# EasyEDA Pro project MG_0428.eprj

# Schematic Schematic1
Board Name: Board1; Create Date: 2025-04-02; Page Name: P1; Project Name: MG_0428; Schematic Name: Schematic1; Update Date: 2025-05-14; Company: 嘉立创EDA; Page Size: A4; Version: V1.0
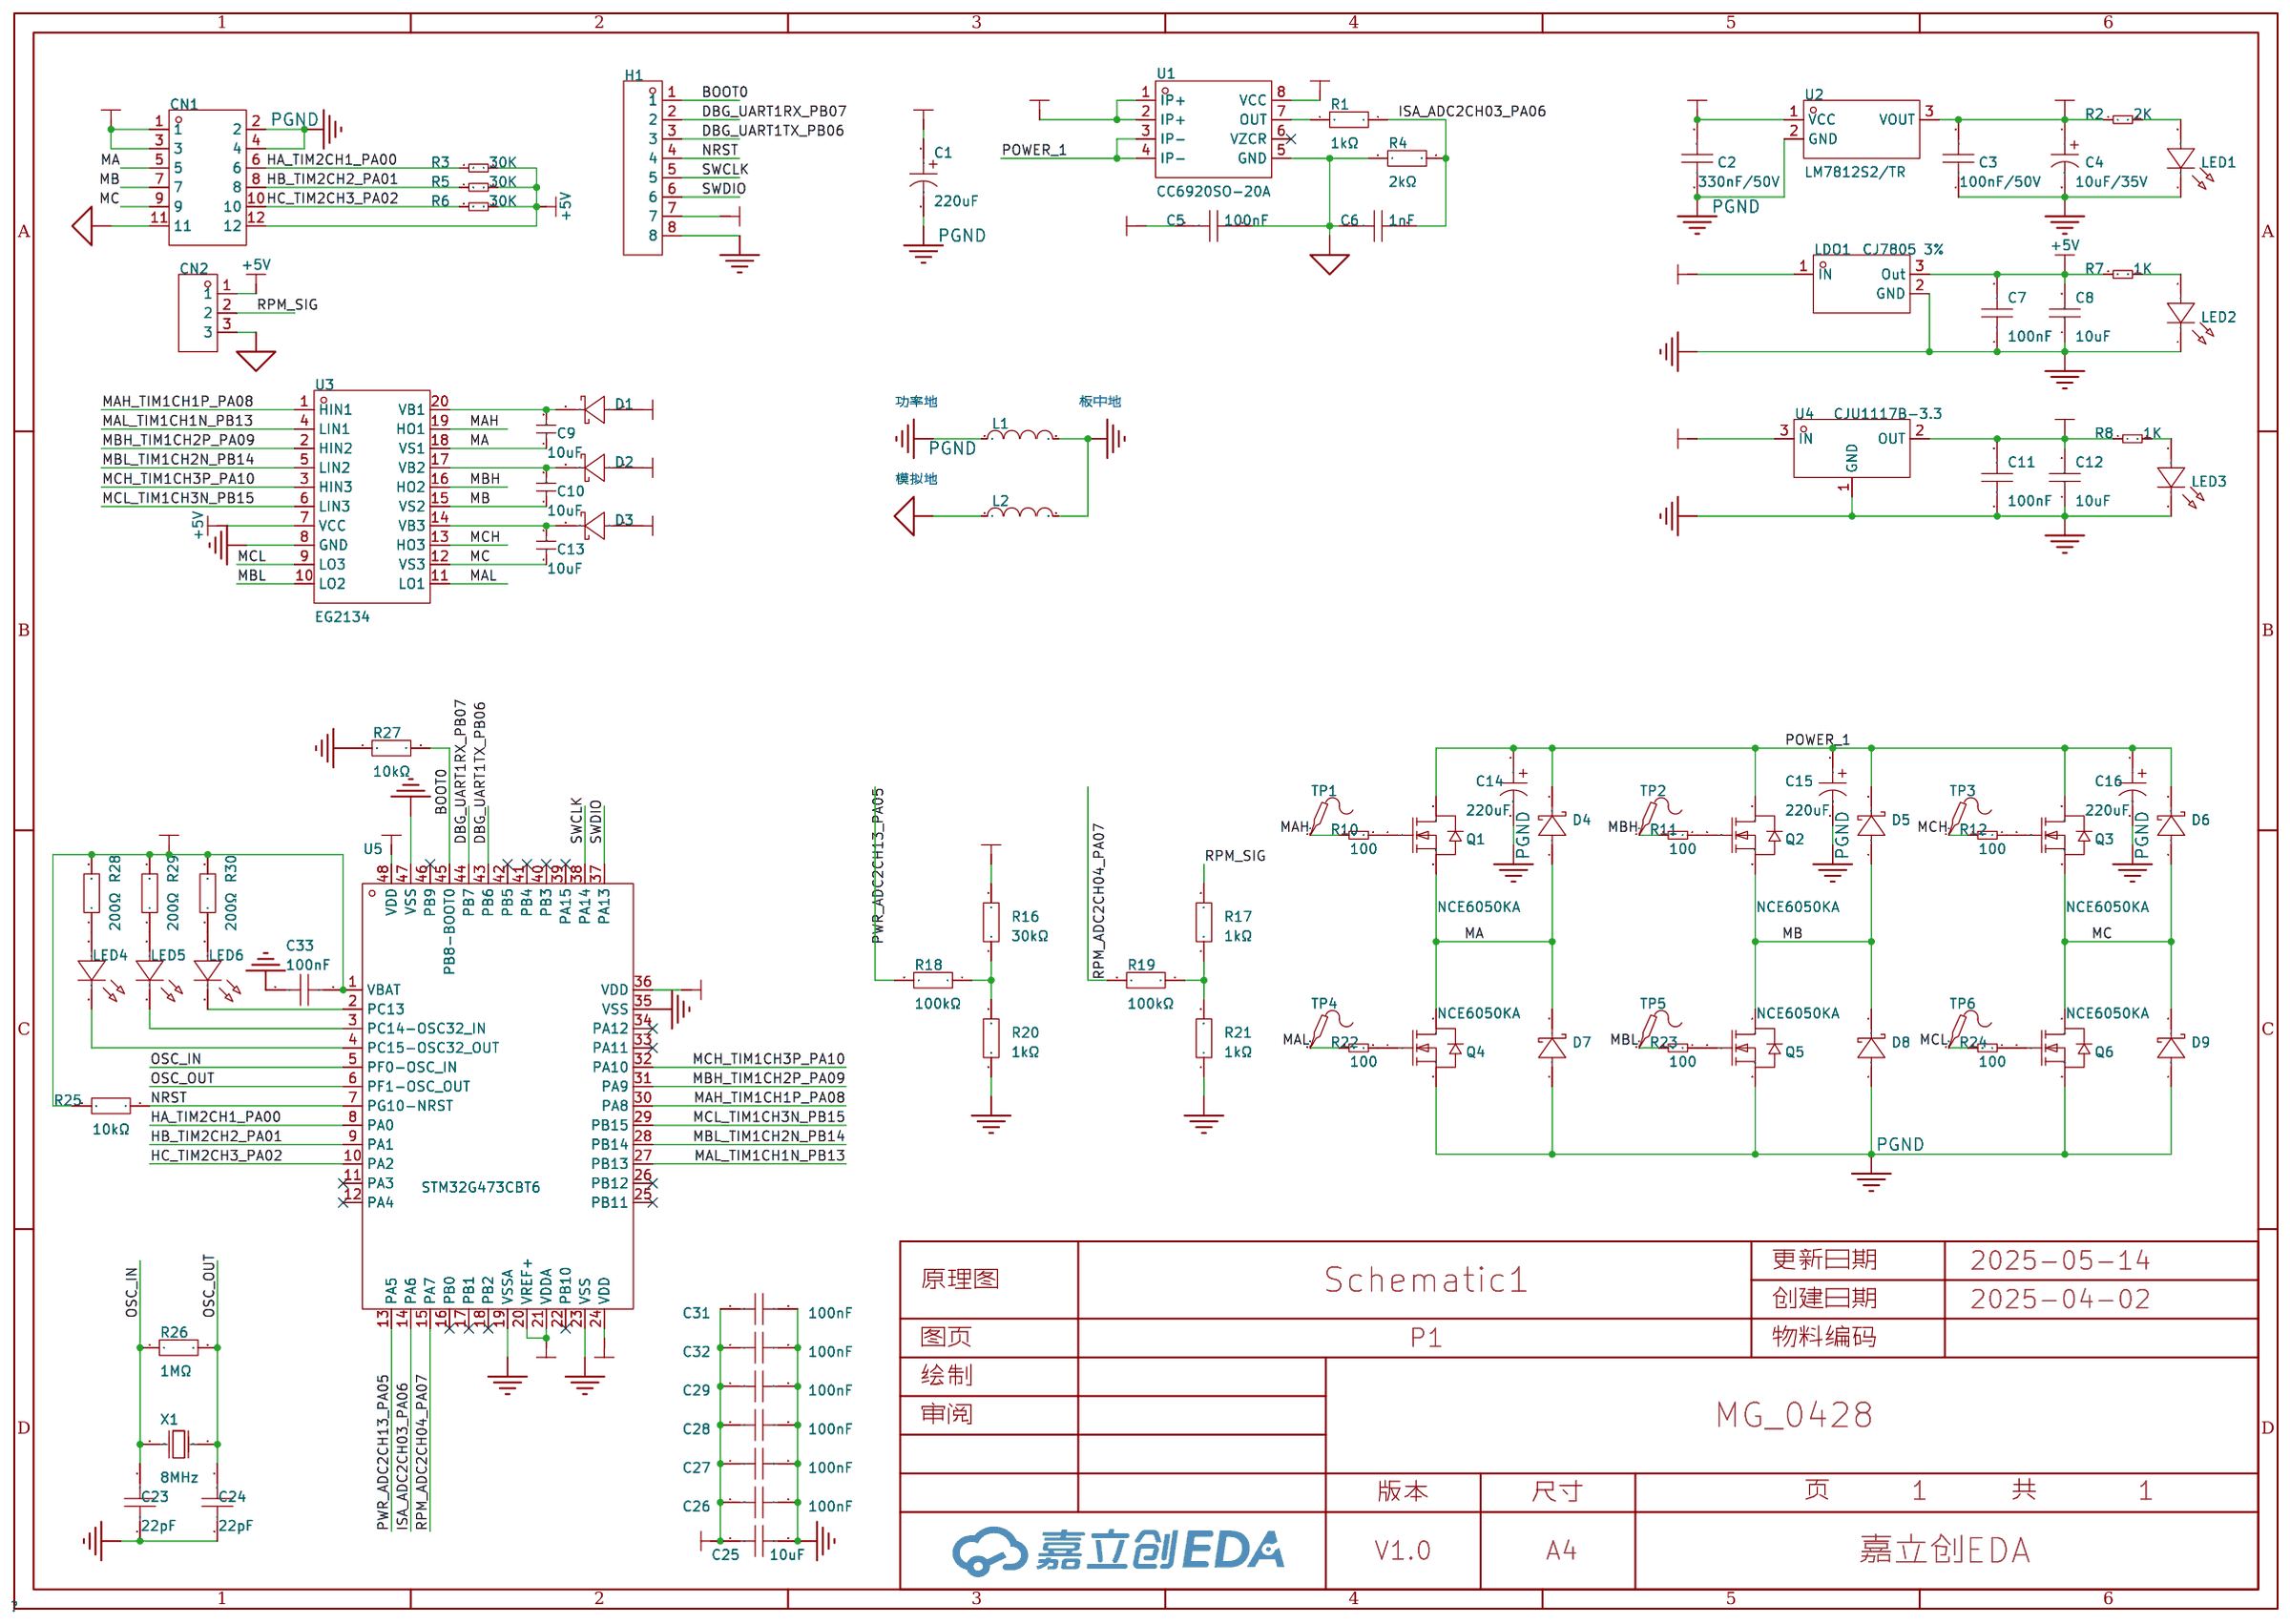
[diagram p0: schematic sheet]

## Parts
C1  220uF  [CAP-SMD_BD10.0-L10.3-W10.3-LS11.0-FD]
C2  330nF/50V  [C0603]
C3  100nF/50V  [C0603]
C4  10uF/35V  [CAP-SMD_BD6.3-L6.6-W6.6-LS7.4-FD]
C5  100nF  [C0603]
C6  1nF  [C0603]
C7  100nF  [C0603]
C8  10uF  [C1206]
C9  10uF  [C0402_NEW]
C10  10uF  [C0402_NEW]
C11  100nF  [C0603]
C12  10uF  [C1206]
C13  10uF  [C0402_NEW]
C14  220uF  [CAP-SMD_BD6.3-L6.6-W6.6-LS7.4-FD]
C15  220uF  [CAP-SMD_BD6.3-L6.6-W6.6-LS7.4-FD]
C16  220uF  [CAP-SMD_BD6.3-L6.6-W6.6-LS7.4-FD]
C23  22pF  [C0402]
C24  22pF  [C0402]
C25  10uF  [C0402]
C26  100nF  [C0402]
C27  100nF  [C0402]
C28  100nF  [C0402]
C29  100nF  [C0402]
C31  100nF  [C0402]
C32  100nF  [C0402]
C33  100nF  [C0402]
CN1  HC-MX3.0-2*6A  [CONN-TH_12P-P3.00_HC-MX3.0-2X6A]
CN2  ZX-XH2.54-3PZZ  [CONN-TH_3P-P2.54_2501S-3P]
D1  BAT46W  [SOD-123_L2.7-W1.6-LS3.7-FD]
D2  BAT46W  [SOD-123_L2.7-W1.6-LS3.7-FD]
D3  BAT46W  [SOD-123_L2.7-W1.6-LS3.7-FD]
D4  BAT46W  [SOD-123_L2.7-W1.6-LS3.7-FD]
D5  BAT46W  [SOD-123_L2.7-W1.6-LS3.7-FD]
D6  BAT46W  [SOD-123_L2.7-W1.6-LS3.7-FD]
D7  BAT46W  [SOD-123_L2.7-W1.6-LS3.7-FD]
D8  BAT46W  [SOD-123_L2.7-W1.6-LS3.7-FD]
D9  BAT46W  [SOD-123_L2.7-W1.6-LS3.7-FD]
H1  PZ254V-11-08P  [HDR-TH_8P-P2.54-V-M]
L1  CBM201209U300T  [L0805]
L2  CBM201209U300T  [L0805]
LDO1  CJ7805 3%  [TO-252-2_L6.6-W6.1-P4.58-LS10.1-BR-CW]
LED1  XL-1608SURC-06  [LED0603-RD_RED]
LED2  XL-1608SURC-06  [LED0603-RD_RED]
LED3  XL-1608SURC-06  [LED0603-RD_RED]
LED4  XL-1608SURC-06  [LED0603-RD_RED]
LED5  XL-1608SURC-06  [LED0603-RD_RED]
LED6  XL-1608SURC-06  [LED0603-RD_RED]
Q1  NCE6050KA  [TO-252-2_L6.6-W6.1-P4.57-LS10.1-TL-CW]
Q2  NCE6050KA  [TO-252-2_L6.6-W6.1-P4.57-LS10.1-TL-CW]
Q3  NCE6050KA  [TO-252-2_L6.6-W6.1-P4.57-LS10.1-TL-CW]
Q4  NCE6050KA  [TO-252-2_L6.6-W6.1-P4.57-LS10.1-TL-CW]
Q5  NCE6050KA  [TO-252-2_L6.6-W6.1-P4.57-LS10.1-TL-CW]
Q6  NCE6050KA  [TO-252-2_L6.6-W6.1-P4.57-LS10.1-TL-CW]
R1  1kΩ  [R0603]
R2  2K  [R0603]
R3  30K  [R0603]
R4  2kΩ  [R0603]
R5  30K  [R0603]
R6  30K  [R0603]
R7  1K  [R0603]
R8  1K  [R0603]
R10  100  [R0603]
R11  100  [R0603]
R12  100  [R0603]
R16  30kΩ  [R0603]
R17  1kΩ  [R0603]
R18  100kΩ  [R0603]
R19  100kΩ  [R0603]
R20  1kΩ  [R0603]
R21  1kΩ  [R0603]
R22  100  [R0603]
R23  100  [R0603]
R24  100  [R0603]
R25  10kΩ  [R0603]
R26  1MΩ  [R0402]
R27  10kΩ  [R0402]
R28  200Ω  [R0402]
R29  200Ω  [R0402]
R30  200Ω  [R0402]
TP1  -  [Test-Point-1mm]
TP2  -  [Test-Point-1mm]
TP3  -  [Test-Point-1mm]
TP4  -  [Test-Point-1mm]
TP5  -  [Test-Point-1mm]
TP6  -  [Test-Point-1mm]
U1  CC6920SO-20A  [SOP-8_L5.0-W4.0-P1.27-LS6.2-BL]
U2  LM7812S2/TR  [TO-263-2_L10.2-W8.7-P5.08-LS15.1-BL]
U3  EG2134  [TSSOP-20_L6.5-W4.4-P0.65-LS6.4-BL]
U4  CJU1117B-3.3  [TO-252-2_L6.6-W6.1-P4.57-LS9.9-TL-CW]
U5  STM32G473CBT6  [LQFP-48_L7.0-W7.0-P0.50-LS9.0-BL]
X1  8MHz  [CRYSTAL-SMD_L5.0-W3.2]

## Library data of the parts
C1 = RVT220UF50V67RV0021: 容值:220uF;精度:±20%;额定电压:50V;纹波电流:230mA@120Hz;等效串联电阻:-;; LCSC Part Name: 220uF ±20% 50V; Supplier Part: C2887271; Manufacturer: KNSCHA(科尼盛); Supplier Footprint: SMD,D10xL10.2mm; Datasheet: https://atta.szlcsc.com/upload/public/pdf/source/20210824/08E695BB4B7EEB96F38ACC5D13E6017A.pdf; Supplier: LCSC; Tolerance: ±20%; Rated Voltage: 50V; Ripple Current: 230mA@120Hz; φD: 10mm; L: 10.2mm; Lifetime @ Temp: 2000hrs@105℃; Operating Temperature: -55℃~+105℃
C2 = TCC0603X7R334K500CT: 容值:330nF;精度:±10%;额定电压:50V;材质(温度系数):X7R;; LCSC Part Name: 330nF ±10% 50V; Supplier Part: C282682; Manufacturer: CCTC(三环); Supplier Footprint: 0603; JLCPCB Part Class: 扩展库; Datasheet: https://atta.szlcsc.com/upload/public/pdf/source/20191203/C466239_F62A586702D44EEA1C39B32FC8662B21.pdf; Supplier: LCSC; Tolerance: ±10%; Voltage Rated: 50V; Temperature Coefficient: X7R
C3 C5-C7 C11 = CC0603KRX7R9BB104: 容值:100nF;精度:±10%;额定电压:50V;材质(温度系数):X7R;; LCSC Part Name: 100nF ±10% 50V; Supplier Part: C14663; Manufacturer: YAGEO(国巨); Supplier Footprint: 0603; JLCPCB Part Class: 基础库; Datasheet: https://atta.szlcsc.com/upload/public/pdf/source/20180910/C282072_33301C7F631E79921B82A8DAC6BCC5B3.pdf; Supplier: LCSC; Tolerance: ±10%; Voltage Rated: 50V; Temperature Coefficient: X7R
C4 C14-C16 = RVT1E221M0607: 容值:220uF;精度:±20%;额定电压:25V;纹波电流:150mA@120Hz;等效串联电阻:-;; LCSC Part Name: 220uF ±20% 25V; Supplier Part: C2918361; Manufacturer: ROQANG(容强); Supplier Footprint: SMD,D6.3xL7.7mm; JLCPCB Part Class: 扩展库; Datasheet: https://atta.szlcsc.com/upload/public/pdf/source/20211118/497C0614266278696CA52BDF245B991F.pdf; Supplier: LCSC; Tolerance: ±20%; Rated Voltage: 25V; Ripple Current: 150mA@120Hz; φD: 6.3mm; L: 7.7mm; Lifetime @ Temp: 2000hrs@105℃; Operating Temperature: -40℃~+105℃
C8 C12 = CL31A106KBHNNNE: 容值:10uF;精度:±10%;额定电压:50V;材质(温度系数):X5R;; LCSC Part Name: 10uF ±10% 50V; Supplier Part: C13585; Manufacturer: SAMSUNG(三星); Supplier Footprint: 1206; Datasheet: https://atta.szlcsc.com/upload/public/pdf/source/20160218/1457707763339.pdf; Supplier: LCSC; Tolerance: ±10%; Voltage Rated: 50V; Temperature Coefficient: X5R
C9 C10 C13 = CAP_0603: Supplier Footprint: 0603
C23 C24 = CC0402FRNPO9BN220: LCSC Part Name: 22pF ±1% 50V; Supplier Part: C277482; Manufacturer: YAGEO(国巨); Supplier Footprint: 0402; JLCPCB Part Class: 扩展库; Datasheet: https://atta.szlcsc.com/upload/public/pdf/source/20181008/C309499_21CC21451B82C39E3D92150FD6B30293.pdf; Supplier: LCSC; Tolerance: ±1%; Voltage Rated: 50V; Temperature Coefficient: NP0
C25 = HGC0402R5106M100NTEJ: LCSC Part Name: 10uF ±20% 10V; Supplier Part: C7472949; Manufacturer: Chinocera(华瓷); Supplier Footprint: 0402; JLCPCB Part Class: 扩展库; Datasheet: https://atta.szlcsc.com/upload/public/pdf/source/20240320/FAC3FEC40A78BC5CCCE96C232A94D860.pdf; Supplier: LCSC; Tolerance: ±20%; Voltage Rated: 10V; Temperature Coefficient: X5R
C26-C29 C31-C33 = CL05B104KB54PNC: LCSC Part Name: 100nF ±10% 50V; Supplier Part: C307331; Manufacturer: SAMSUNG(三星); Supplier Footprint: 0402; JLCPCB Part Class: 基础库; Datasheet: https://atta.szlcsc.com/upload/public/pdf/source/20160218/1457707763339.pdf; Supplier: LCSC; Tolerance: ±10%; Voltage Rated: 50V; Temperature Coefficient: X7R
CN1 = HC-MX3.0-2*6A: LCSC Part Name: 2x6P 间距:3mm 直插 系列:Micro-Fit(MX 3.0); Supplier Part: C3294375; Manufacturer: HCTL(华灿天禄); Supplier Footprint: 插件,P=3mm; JLCPCB Part Class: 扩展库; Datasheet: https://atta.szlcsc.com/upload/public/pdf/source/20240325/6515A412CF75DC76B766B405583CF347.pdf; Supplier: LCSC; Pins Structure: 2x6P; Pitch: 3mm; Mounting Style: 直插; Reference Series: Micro-Fit(MX 3.0); Number of Pins: 12P; Number of Rows: 2; Number of PINs Per Row: 6; Row Spacing: 3mm; Current Rating (Max): 5A; Contact Material: 黄铜; Contact Plating: 锡; Operating Temperature Range: -25℃~+85℃; Rated Voltage (Max): 250V; Plastic Material: PA66; Colour: 黑色; Z-Height of the Board: 9.9mm; X-Length of Bottom Edge on Board (Spacing Line): 21.6mm
CN2 = ZX-XH2.54-3PZZ: LCSC Part Name: 1x3P 间距:2.5mm 直插 系列:XH; Supplier Part: C7429633; Manufacturer: Megastar(兆星); Supplier Footprint: 插件,P=2.5mm; JLCPCB Part Class: 扩展库; Datasheet: https://atta.szlcsc.com/upload/public/pdf/source/20230619/AE17037A2CFDBE8D9CBA775D61AD0A84.pdf; Supplier: LCSC; Pins Structure: 1x3P; Pitch: 2.5mm; Mounting Type: 直插; Reference Series: XH; Number of Pins: 3P; Number of Rows: 1; Number of PINs Per Row: 3; Rated Current: 3A; Contact Material: 黄铜; Contact Plating: 锡; Operating Temperature: -25℃~+85℃; Rated Voltage (Max): 250V; Plastic Material: PA66; Flame Retardant Rating: UL94V-0; Color: 白色; Z-Height of the Board: 7mm; X-Length of Bottom Edge on Board (Spacing Line): 10mm; Y-Width of Bottom Edge on Board: 5.9mm
D1-D9 = BAT46W_C7420332: 二极管配置:独立式;正向压降(Vf):450mV@10mA;直流反向耐压(Vr):100V;整流电流:150mA;; LCSC Part Name: 电压:100V 电流:150mA; Supplier Part: C7420332; Manufacturer: 宏迦橙; Supplier Footprint: SOD-123; JLCPCB Part Class: 扩展库; Datasheet: https://atta.szlcsc.com/upload/public/pdf/source/20230828/8D46A0517F4B4BAF48FFED0515F66B7C.pdf; Supplier: LCSC; Diode Configuration: 独立式; Forward Voltage (Vf@If): 450mV@10mA; Reverse Voltage (Vr): 100V; Rectified Current: 150mA; Reverse Leakage Current (Ir): 2uA@100V
H1 = PZ254V-11-08P: LCSC Part Name: 间距:2.54mm 1x8P 直插 方针; Supplier Part: C492407; Manufacturer: XFCN(兴飞); Supplier Footprint: 插件,P=2.54mm; JLCPCB Part Class: 扩展库; Datasheet: https://atta.szlcsc.com/upload/public/pdf/source/20200309/C492407_83A6FB26A2233368EDB9516968EC6149.pdf; Supplier: LCSC; Pin Structure: 1x8P; Pitch: 2.54mm; Circluar Pins/Square Pins: 方针; Mounting Type: 直插; Number of Rows: 单排; Number of Pins: 8P; Length of Mating Pin: 6mm; Insulation Height: 2.5mm; Length of End Connection Pin: 3mm; Contact Material: 黄铜; Operating Temperature Range: -40℃~+105℃; Color: 黑色
L1 L2 = CBM201209U300T: 标称阻抗@测试频率:30Ω@100MHz;误差:±25%;直流电阻(RDC):10mΩ;; LCSC Part Name: 单路 0805磁珠 阻抗30Ω@100MHz; Supplier Part: C268310; Manufacturer: FH(风华); Supplier Footprint: 0805; JLCPCB Part Class: 扩展库; Datasheet: https://atta.szlcsc.com/upload/public/pdf/source/20180917/C294510_876BBCD5BD7C9EF2E8468360D8BC49D0.pdf; Supplier: LCSC; Impedance @ Frequency: 30Ω@100MHz; Tolerance: ±25%; DC Resistance: 10mΩ; Current Rating: 6A; Circuits: 1
LDO1 = CJ7805 3%: 输出类型:固定;最大输入电压:35V;输出电压:5V;最大输出电流:1.5A;输出极性:正极;; LCSC Part Name: 输入35V 输出5V 1.5A; Supplier Part: C21706; Manufacturer: CJ(江苏长电/长晶); Supplier Footprint: TO-252-2(DPAK); Datasheet: https://atta.szlcsc.com/upload/public/pdf/source/20171228/C164904_15144413121361213907.pdf; Supplier: LCSC; Output Type: 固定; Maximum Input Voltage: 35V; Output Voltage: 5V; MAX Output Current: 1.5A; Dropout Voltage: 2V@(1A); Output Polarity: 正极; Number of Outputs: 1
LED1-LED6 = XL-1608SURC-06: 发光颜色:红色;功率:55mW;正向电流:25mA;主波长:617nm~621nm;透镜颜色:无色透明透镜;色温:-;发光角度:120°;载带方式:正贴;工作温度:-30℃~+85℃;; Supplier Part: C965799; Manufacturer: XINGLIGHT(成兴光); Supplier Footprint: 0603; JLCPCB Part Class: 扩展库; Datasheet: https://atta.szlcsc.com/upload/public/pdf/source/20221102/D860AFDD1CDB02C5A8064103A32707E2.pdf; Supplier: LCSC; Emitted Color: 红色; Power Dissipation: 55mW; Forward Current: 25mA; Dominant Wavelength: 617nm~621nm; Peak Wavelength: 623nm; Lens Color: 无色透明透镜; Viewing Angle: 120°; Mounting Sytle: 正贴; Operating Temperature: -30℃~+85℃
Q1-Q6 = NCE6050KA: 类型:1个N沟道;漏源电压(Vdss):60V;连续漏极电流(Id):50A;功率(Pd):85W;导通电阻(RDS(on)@Vgs,Id):20mΩ@10V,20A;阈值电压(Vgs(th)@Id):2.5V@250uA;; LCSC Part Name: 1个N沟道 耐压:60V 电流:50A; Supplier Part: C96013; Manufacturer: NCE(无锡新洁能); Supplier Footprint: TO-252-2(DPAK); JLCPCB Part Class: 扩展库; Datasheet: https://atta.szlcsc.com/upload/public/pdf/source/20170228/1488267686631.pdf; Supplier: LCSC; Type: 1个N沟道; Drain Source Voltage (Vdss): 60V; Continuous Drain Current (Id): 50A; Power Dissipation (Pd): 85W; Drain Source On Resistance (RDS(on)@Vgs,Id): 20mΩ@10V,20A; Gate Threshold Voltage (Vgs(th)@Id): 2.5V@250uA
R1 R4 R16-R21 R25 = 0603WAF1002T5E: 电阻类型:厚膜电阻;阻值:10kΩ;精度:±1%;功率:100mW;最大工作电压:75V;温度系数:±100ppm/℃;; LCSC Part Name: 厚膜电阻 10kΩ ±1% 100mW; Supplier Part: C25804; Manufacturer: UNI-ROYAL(厚声); Supplier Footprint: 0603; JLCPCB Part Class: Basic Part; Datasheet: https://atta.szlcsc.com/upload/public/pdf/source/20200306/C422600_1E6D84923E4A46A82E41ADD87F860B5C.pdf; Supplier: LCSC; Type: 厚膜电阻; Tolerance: ±1%; Power(Watts): 100mW; Overload Voltage (Max): 75V; Temperature Coefficient: ±100ppm/℃; Operating Temperature Range: -55℃~+155℃
R2 R3 R5-R8 R10-R12 R22-R24 = Res_0603: Supplier Footprint: 0603
R26 = 0402WGF1004TCE: LCSC Part Name: 1MΩ ±1% 62.5mW 厚膜电阻; Supplier Part: C26083; Manufacturer: UNI-ROYAL(厚声); Supplier Footprint: 0402; JLCPCB Part Class: 基础库; Datasheet: https://atta.szlcsc.com/upload/public/pdf/source/20200306/C422600_1E6D84923E4A46A82E41ADD87F860B5C.pdf; Supplier: LCSC; Type: 厚膜电阻; Tolerance: ±1%; Power(Watts): 62.5mW; Overload Voltage (Max): 50V; Temperature Coefficient: ±100ppm/℃; Operating Temperature Range: -55℃~+155℃
R27 = 0402WGF1002TCE: LCSC Part Name: 10kΩ ±1% 62.5mW 厚膜电阻; Supplier Part: C25744; Manufacturer: UNI-ROYAL(厚声); Supplier Footprint: 0402; JLCPCB Part Class: 基础库; Datasheet: https://atta.szlcsc.com/upload/public/pdf/source/20200306/C422600_1E6D84923E4A46A82E41ADD87F860B5C.pdf; Supplier: LCSC; Type: 厚膜电阻; Tolerance: ±1%; Power(Watts): 62.5mW; Overload Voltage (Max): 50V; Temperature Coefficient: ±100ppm/℃; Operating Temperature Range: -55℃~+155℃
R28-R30 = 0402WGF2000TCE: LCSC Part Name: 200Ω ±1% 62.5mW 厚膜电阻; Supplier Part: C25087; Manufacturer: UNI-ROYAL(厚声); Supplier Footprint: 0402; JLCPCB Part Class: 基础库; Datasheet: https://atta.szlcsc.com/upload/public/pdf/source/20200306/C422600_1E6D84923E4A46A82E41ADD87F860B5C.pdf; Supplier: LCSC; Type: 厚膜电阻; Tolerance: ±1%; Power(Watts): 62.5mW; Overload Voltage (Max): 50V; Temperature Coefficient: ±100ppm/℃; Operating Temperature Range: -55℃~+155℃
TP1-TP6 = Test-Point: Test Point 测试点
U1 = CC6920SO-20A: Supplier Part: C2760489; Manufacturer: CrossChip(成都芯进); Supplier Footprint: SOP-8; JLCPCB Part Class: 扩展库; Datasheet: https://atta.szlcsc.com/upload/public/pdf/source/20210315/C2760487_ED4074ABFE9AB3AA8D2C43CB30AB0C5E.pdf; Supplier: LCSC
U2 = LM7812S2/TR: 线性稳压器(LDO)   固定电压稳压器; Supplier Part: C7432181; Manufacturer: HGSEMI(华冠); Supplier Footprint: TO-263-2; JLCPCB Part Class: 扩展库; Supplier: LCSC
U3 = EG2134: LCSC Part Name: EG2134 TSSOP20; Supplier Part: C480661; Manufacturer: EG(屹晶微); Supplier Footprint: TSSOP-20; JLCPCB Part Class: 扩展库; Datasheet: https://atta.szlcsc.com/upload/public/pdf/source/20200107/C480661_235F21EC73D073F149882C12A613FF28.pdf; Supplier: LCSC
U4 = CJU1117B-3.3: 最大输入电压:20V;输出电压:3.3V;最大输出电流:1A;电源纹波抑制比(PSRR):65dB;; LCSC Part Name: 1A LOW DROPOUT LINEAR REGULATOR; Supplier Part: C3031942; Manufacturer: CJ(江苏长电/长晶); Supplier Footprint: TO-252-2; Datasheet: https://atta.szlcsc.com/upload/public/pdf/source/20220608/C61B3D65B310BBCD56AB7D1C65D3C638.pdf; Supplier: LCSC; Maximum Input Voltage: 20V; Output Voltage: 3.3V; MAX Output Current: 1A; Power Supply Rejection Ratio (PSRR): 65dB; Dropout Voltage: 1.3V; standby current: 10mA
U5 = STM32G473CBT6: LCSC Part Name: 带DSP和FPU的170MHz主流ARM Cortex-M4 MCU，具有128 KB Flash存储器、数学加速器和高模拟电平集成; Supplier Part: C730111; Manufacturer: ST(意法半导体); Supplier Footprint: LQFP-48(7x7); JLCPCB Part Class: 扩展库; Datasheet: https://atta.szlcsc.com/upload/public/pdf/source/20200902/C730111_19331807E2800E1C1C13BFFAAC550E20.pdf; Supplier: LCSC
X1 = X50328MSB2GI: 晶振类型:贴片晶振;频率:8MHz;常温频差:±10ppm;外接负载电容:20pF;频率稳定度(全温):±20ppm;; LCSC Part Name: 8MHz ±10ppm 20pF YSX530GA; Supplier Part: C115962; Manufacturer: YXC(扬兴晶振); Supplier Footprint: SMD5032; Datasheet: https://atta.szlcsc.com/upload/public/pdf/source/20240329/44922B0AF7B60E58E9B66993B6077277.pdf; Supplier: LCSC; Crystal Type: 贴片晶振; Normal temperature Frequency Tolerance: ±10ppm; External load capacitor: 20pF; Frequency Stability(Full temperature range): ±20ppm; Operating Temperature: -40℃~+85℃

## Nets
3V3: C11.2 C12.2 C25.1 C26.1 C27.1 C28.1 C29.1 C31.1 C32.1 C33.2 H1.7 R8.1 R25.2 R28.2 R29.2 R30.2 U4.2(OUT) U5.1(VBAT) U5.20(VREF+) U5.21(VDDA) U5.24(VDD) U5.36(VDD) U5.48(VDD)
12V: C3.2 C4.1 D1.1(A) D2.1(A) D3.1(A) LDO1.1(IN) R2.1 U2.3(VOUT) U4.3(IN)
+5V: C5.2 C7.2 C8.2 CN1.12 CN2.1 LDO1.3(Out) R3.1 R5.1 R6.1 R7.1 U1.8(VCC) U3.7(VCC)
AGND: C5.1 C6.1 CN1.11 CN2.3 L2.1 R4.2 U1.5(GND)
GND: C3.1 C4.2 C7.1 C8.1 C11.1 C12.1 C23.1 C24.1 C25.2 C26.2 C27.2 C28.2 C29.2 C31.2 C32.2 C33.1 H1.8 L1.2 L2.2 LDO1.2(GND) LED1.1(K) LED2.1(K) LED3.1(K) R20.1 R21.1 R27.1 U3.8(GND) U4.1(GND) U5.19(VSSA) U5.23(VSS) U5.35(VSS) U5.47(VSS)
PGND: C1.2 C2.1 C14.2 C15.2 C16.2 CN1.2 CN1.4 D7.1(A) D8.1(A) D9.1(A) L1.1 Q4.3(S) Q5.3(S) Q6.3(S) U2.2(GND)
BOOT0: H1.1 R27.2 U5.45(PB8-BOOT0)
DBG_UART1RX_PB07: H1.2 U5.44(PB7)
DBG_UART1TX_PB06: H1.3 U5.43(PB6)
HA_TIM2CH1_PA00: CN1.6 R3.2 U5.8(PA0)
HB_TIM2CH2_PA01: CN1.8 R5.2 U5.9(PA1)
HC_TIM2CH3_PA02: CN1.10 R6.2 U5.10(PA2)
ISA_ADC2CH03_PA06: C6.2 R1.1 R4.1 U5.14(PA6)
MA: C9.1 CN1.5 D4.1(A) D7.2(K) Q1.3(S) Q4.2(D) U3.18(VS1)
MAH: R10.2 TP1.1 U3.19(HO1)
MAH_TIM1CH1P_PA08: U3.1(HIN1) U5.30(PA8)
MAL: R22.2 TP4.1 U3.11(LO1)
MAL_TIM1CH1N_PB13: U3.4(LIN1) U5.27(PB13)
MB: C10.1 CN1.7 D5.1(A) D8.2(K) Q2.3(S) Q5.2(D) U3.15(VS2)
MBH: R11.2 TP2.1 U3.16(HO2)
MBH_TIM1CH2P_PA09: U3.2(HIN2) U5.31(PA9)
MBL: R23.2 TP5.1 U3.10(LO2)
MBL_TIM1CH2N_PB14: U3.5(LIN2) U5.28(PB14)
MC: C13.1 CN1.9 D6.1(A) D9.2(K) Q3.3(S) Q6.2(D) U3.12(VS3)
MCH: R12.2 TP3.1 U3.13(HO3)
MCH_TIM1CH3P_PA10: U3.3(HIN3) U5.32(PA10)
MCL: R24.2 TP6.1 U3.9(LO3)
MCL_TIM1CH3N_PB15: U3.6(LIN3) U5.29(PB15)
NRST: H1.4 R25.1 U5.7(PG10-NRST)
OSC_IN: C23.2 R26.1 U5.5(PF0-OSC_IN) X1.2(OSC2)
OSC_OUT: C24.2 R26.2 U5.6(PF1-OSC_OUT) X1.1(OSC1)
POWER: C1.1 C2.2 CN1.1 CN1.3 R16.2 U1.1(IP+) U1.2(IP+) U2.1(VCC)
POWER_1: C14.1 C15.1 C16.1 D4.2(K) D5.2(K) D6.2(K) Q1.2(D) Q2.2(D) Q3.2(D) U1.3(IP-) U1.4(IP-)
PWR_ADC2CH13_PA05: R18.2 U5.13(PA5)
RPM_ADC2CH04_PA07: R19.2 U5.15(PA7)
RPM_SIG: CN2.2 R17.2
SWCLK: H1.5 U5.38(PA14)
SWDIO: H1.6 U5.37(PA13)
$1N16736: Q1.1(G) R10.1
$1N16739: Q4.1(G) R22.1
$1N16742: Q2.1(G) R11.1
$1N16745: Q5.1(G) R23.1
$1N16748: Q3.1(G) R12.1
$1N16751: Q6.1(G) R24.1
$1N16780: LED2.2(A) R7.2
$1N16782: LED1.2(A) R2.2
$1N16797: C9.2 D1.2(K) U3.20(VB1)
$1N16798: C10.2 D2.2(K) U3.17(VB2)
$1N16799: C13.2 D3.2(K) U3.14(VB3)
$1N16821: LED3.2(A) R8.2
$1N16860: LED6.1(K) U5.2(PC13)
$1N16861: LED5.1(K) U5.3(PC14-OSC32_IN)
$1N16862: LED4.1(K) U5.4(PC15-OSC32_OUT)
$1N17260: R1.2 U1.7(OUT)
$1N17439: R16.1 R18.1 R20.2
$1N20263: R17.1 R19.1 R21.2
$1N23779: LED4.2(A) R28.1
$1N23819: LED5.2(A) R29.1
$1N23859: LED6.2(A) R30.1

Not connected (* = marked no-connect by the designer): U1 6(VZCR)*; U5 11(PA3)* 12(PA4)* 16(PB0)* 17(PB1)* 18(PB2)* 22(PB10)* 25(PB11)* 26(PB12)* 33(PA11)* 34(PA12)* 39(PA15)* 40(PB3)* 41(PB4)* 42(PB5)* 46(PB9)*

## Notes on the sheet
- 功率地
- 板中地
- 模拟地

# Board PCB1
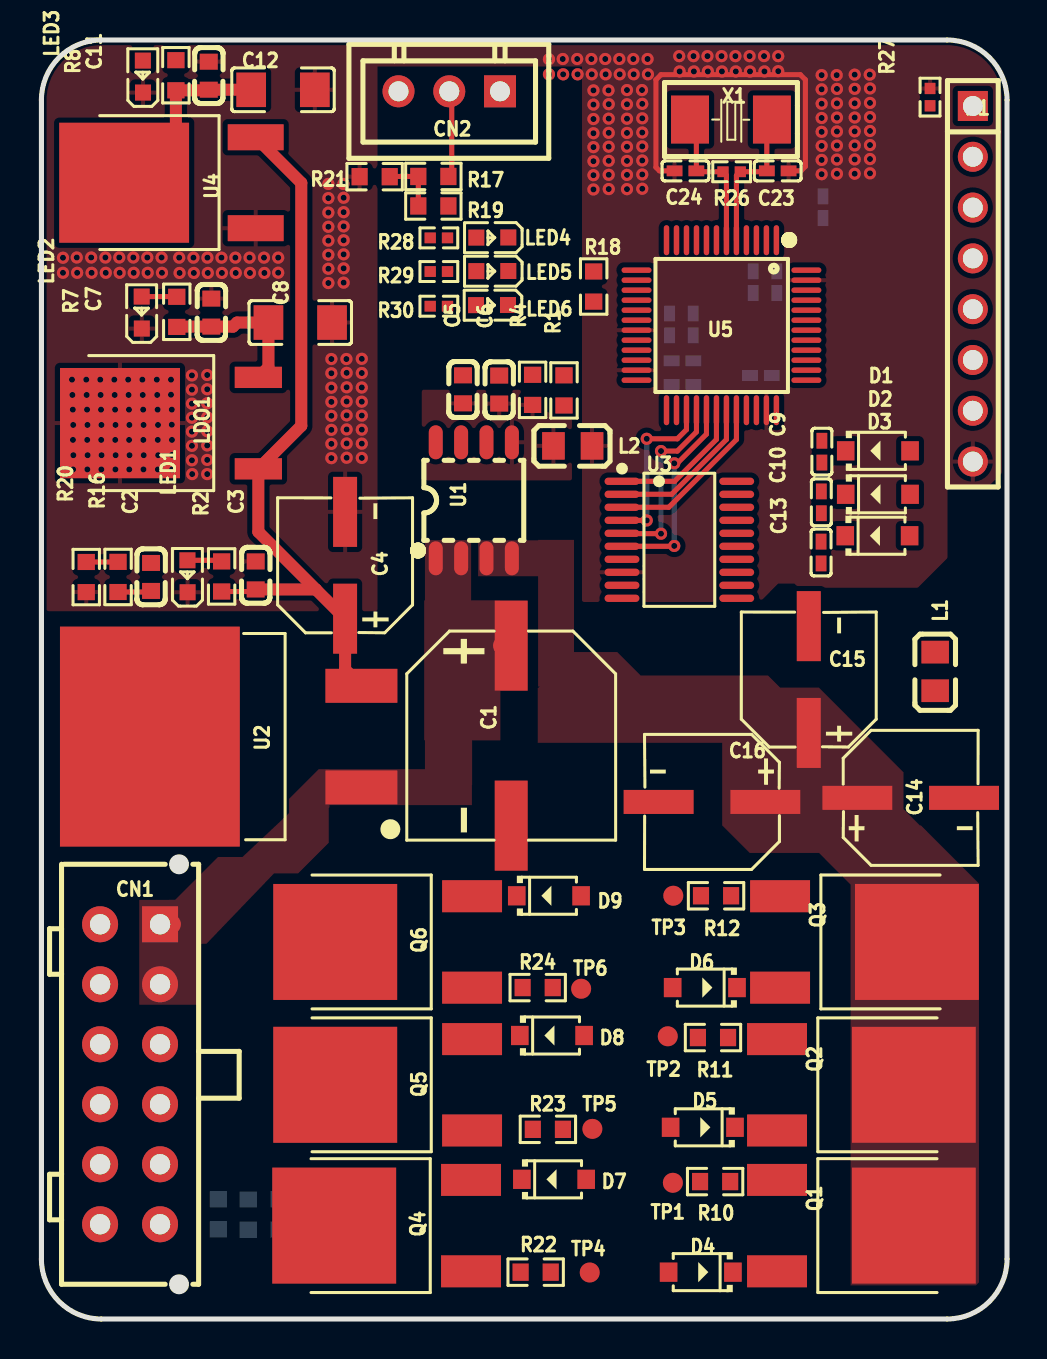
[diagram p1: board, top side]
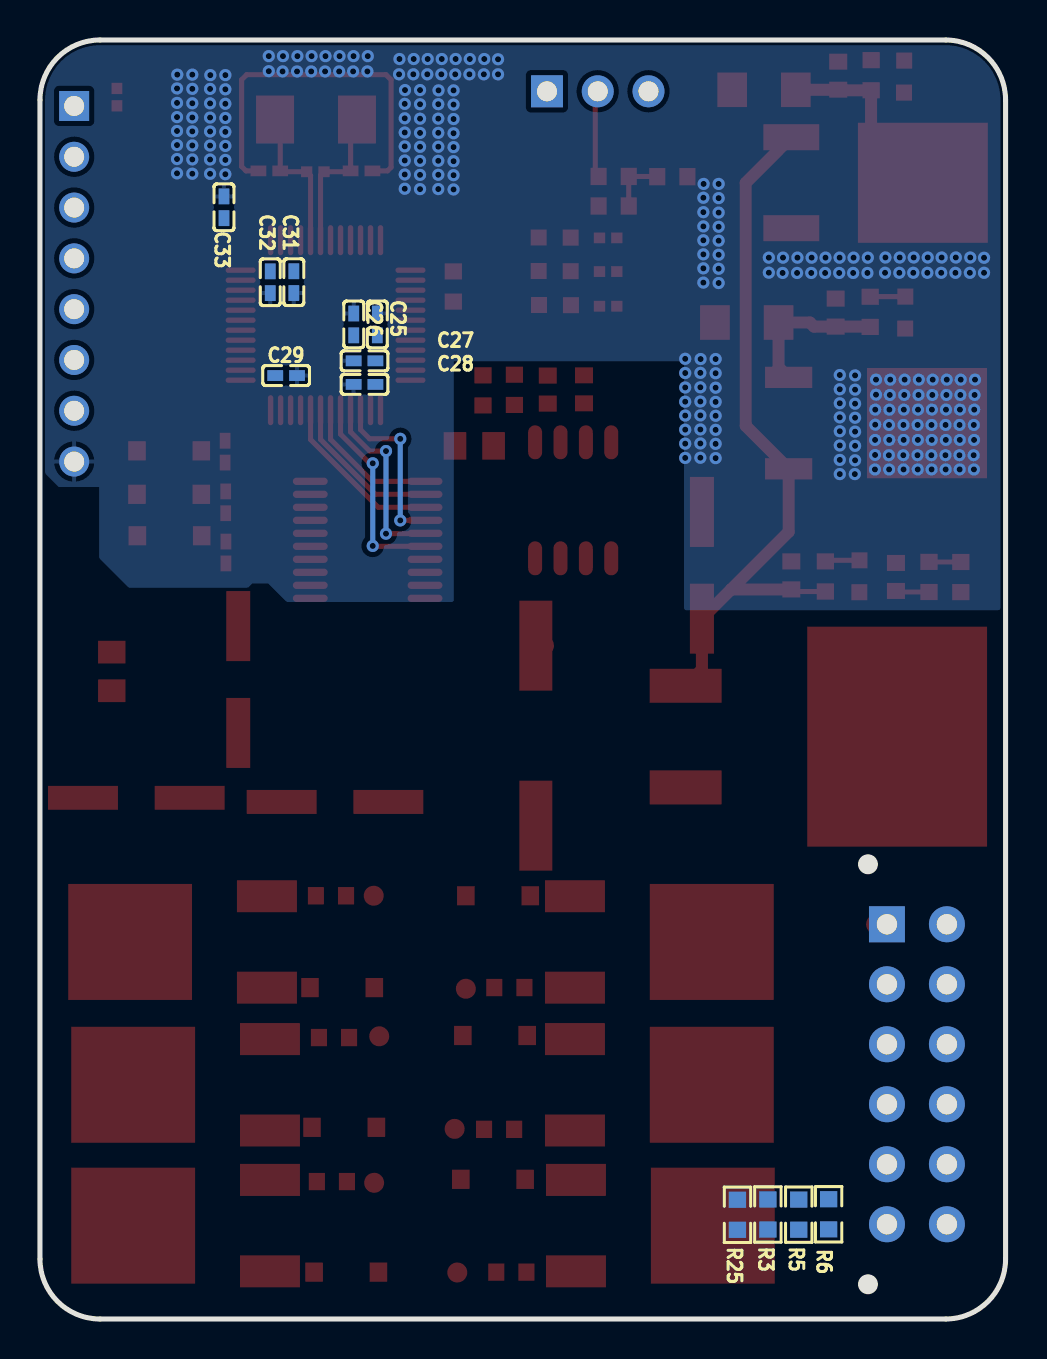
[diagram p2: board, bottom side, seen from below]

Outline 48.33 x 63.95 mm; copper layers: Top Layer, Bottom Layer. Coordinates in mm from the lower left corner of the outline.
Outline path: 0,60.95 0,3 arc(0.88,0.88) 3,0 45.33,0 arc(47.45,0.88) 48.33,3 48.33,60.95 arc(47.45,63.07) 45.33,63.95 3,63.95 arc(0.88,63.07) 0,60.95
Stack: Top Layer 0.035mm / Dielectric1 1.51mm FR4 er 4.5 / Bottom Layer 0.035mm

## Design rules (mm)
template: JLCPCB Capability(Two Layers Board)
spacing copperThickness1oz (default): track to track 0.102, other pairs 0.152 to 0.3
spacing copperThickness2oz: track to track 0.203, other pairs 0.152 to 0.3
track width copperThickness1oz (default): min 0.127, default 0.254, max 2.54
track width copperThickness2oz: min 0.203, default 0.254, max 2.54
differential pair differentialPair (default): width min 0.127, default 0.254, max 2.54; gap min 0.152, default 0.152
via viaSize (default): diameter min 0.5, default 0.61, max 10; hole min 0.3, default 0.305, max 6.3

## Placement (name value [footprint] x y rotation side)
C1  220uF  [CAP-SMD_BD10.0-L10.3-W10.3-LS11.0-FD]  23.51 29.17 270 top
C2  330nF/50V  [C0603]  5.49 37.1 270 top
C3  100nF/50V  [C0603]  10.72 37.18 270 top
C4  10uF/35V  [CAP-SMD_BD6.3-L6.6-W6.6-LS7.4-FD]  15.2 37.69 90 top
C5  100nF  [C0603]  21.1 46.48 90 top
C6  1nF  [C0603]  22.91 46.47 90 top
C7  100nF  [C0603]  8.5 50.32 270 top
C8  10uF  [C1206]  12.95 49.82 180 top
C9  10uF  [C0402_NEW]  39.06 43.37 90 top
C10  10uF  [C0402_NEW]  39.03 40.84 90 top
C11  100nF  [C0603]  8.37 62.17 270 top
C12  10uF  [C1206]  12.09 61.46 180 top
C13  10uF  [C0402_NEW]  39.02 38.33 90 top
C14  220uF  [CAP-SMD_BD6.3-L6.6-W6.6-LS7.4-FD]  43.5 26.06 0 top
C15  220uF  [CAP-SMD_BD6.3-L6.6-W6.6-LS7.4-FD]  38.4 31.97 90 top
C16  220uF  [CAP-SMD_BD6.3-L6.6-W6.6-LS7.4-FD]  33.56 25.85 180 top
C23  22pF  [C0402]  36.85 57.41 180 top
C24  22pF  [C0402]  32.23 57.41 0 top
C25  10uF  [C0402]  31.44 49.73 90 bottom
C26  100nF  [C0402]  32.62 49.73 90 bottom
C27  100nF  [C0402]  32.08 47.91 0 bottom
C28  100nF  [C0402]  32.08 46.73 0 bottom
C29  100nF  [C0402]  36.01 47.17 180 bottom
C31  100nF  [C0402]  35.62 51.84 270 bottom
C32  100nF  [C0402]  36.8 51.84 270 bottom
C33  100nF  [C0402]  39.12 55.59 270 bottom
CN1  HC-MX3.0-2*6A  [CONN-TH_12P-P3.00_HC-MX3.0-2X6A]  4.44 12.24 270 top
CN2  ZX-XH2.54-3PZZ  [CONN-TH_3P-P2.54_2501S-3P]  20.41 61.39 180 top
D1  BAT46W  [SOD-123_L2.7-W1.6-LS3.7-FD]  41.86 43.41 180 top
D2  BAT46W  [SOD-123_L2.7-W1.6-LS3.7-FD]  41.86 41.24 180 top
D3  BAT46W  [SOD-123_L2.7-W1.6-LS3.7-FD]  41.84 39.16 180 top
D4  BAT46W  [SOD-123_L2.7-W1.6-LS3.7-FD]  33 2.34 0 top
D5  BAT46W  [SOD-123_L2.7-W1.6-LS3.7-FD]  33.1 9.59 0 top
D6  BAT46W  [SOD-123_L2.7-W1.6-LS3.7-FD]  33.2 16.57 0 top
D7  BAT46W  [SOD-123_L2.7-W1.6-LS3.7-FD]  25.65 6.98 180 top
D8  BAT46W  [SOD-123_L2.7-W1.6-LS3.7-FD]  25.55 14.18 180 top
D9  BAT46W  [SOD-123_L2.7-W1.6-LS3.7-FD]  25.4 21.16 180 top
H1  PZ254V-11-08P  [HDR-TH_8P-P2.54-V-M]  46.61 51.76 270 top
L1  CBM201209U300T  [L0805]  44.73 32.38 90 top
L2  CBM201209U300T  [L0805]  26.59 43.66 0 top
LDO1  CJ7805 3%  [TO-252-2_L6.6-W6.1-P4.58-LS10.1-BR-CW]  7.39 44.8 0 top
LED1  XL-1608SURC-06  [LED0603-RD_RED]  7.31 37.14 90 top
LED2  XL-1608SURC-06  [LED0603-RD_RED]  5.02 50.32 90 top
LED3  XL-1608SURC-06  [LED0603-RD_RED]  5.08 62.12 90 top
LED4  XL-1608SURC-06  [LED0603-RD_RED]  22.57 54.07 180 top
LED5  XL-1608SURC-06  [LED0603-RD_RED]  22.57 52.4 180 top
LED6  XL-1608SURC-06  [LED0603-RD_RED]  22.55 50.7 180 top
Q1  NCE6050KA  [TO-252-2_L6.6-W6.1-P4.57-LS10.1-TL-CW]  40.24 4.67 0 top
Q2  NCE6050KA  [TO-252-2_L6.6-W6.1-P4.57-LS10.1-TL-CW]  40.24 11.71 0 top
Q3  NCE6050KA  [TO-252-2_L6.6-W6.1-P4.57-LS10.1-TL-CW]  40.39 18.85 0 top
Q4  NCE6050KA  [TO-252-2_L6.6-W6.1-P4.57-LS10.1-TL-CW]  18.08 4.67 180 top
Q5  NCE6050KA  [TO-252-2_L6.6-W6.1-P4.57-LS10.1-TL-CW]  18.13 11.71 180 top
Q6  NCE6050KA  [TO-252-2_L6.6-W6.1-P4.57-LS10.1-TL-CW]  18.13 18.85 180 top
R1  1kΩ  [R0603]  26.15 46.43 270 top
R2  2K  [R0603]  9.02 37.13 90 top
R3  30K  [R0603]  11.9 5.23 270 bottom
R4  2kΩ  [R0603]  24.58 46.46 270 top
R5  30K  [R0603]  10.35 5.22 270 bottom
R6  30K  [R0603]  8.86 5.24 270 bottom
R7  1K  [R0603]  6.77 50.36 90 top
R8  1K  [R0603]  6.73 62.19 90 top
R10  100  [R0603]  33.72 6.87 180 top
R11  100  [R0603]  33.61 14.07 180 top
R12  100  [R0603]  33.76 21.16 180 top
R16  30kΩ  [R0603]  3.84 37.1 270 top
R17  1kΩ  [R0603]  19.62 57.13 0 top
R18  100kΩ  [R0603]  27.64 51.63 90 top
R19  100kΩ  [R0603]  19.62 55.65 0 top
R20  1kΩ  [R0603]  2.24 37.1 90 top
R21  1kΩ  [R0603]  16.68 57.12 0 top
R22  100  [R0603]  24.74 2.34 0 top
R23  100  [R0603]  25.35 9.48 0 top
R24  100  [R0603]  24.84 16.57 0 top
R25  10kΩ  [R0603]  13.42 5.21 90 bottom
R26  1MΩ  [R0402]  34.54 57.36 180 top
R27  10kΩ  [R0402]  44.47 61.1 270 top
R28  200Ω  [R0402]  19.89 54.06 180 top
R29  200Ω  [R0402]  19.89 52.37 180 top
R30  200Ω  [R0402]  19.89 50.64 180 top
TP1  -  [Test-Point-1mm]  31.6 6.81 0 top
TP2  -  [Test-Point-1mm]  31.35 14.14 0 top
TP3  -  [Test-Point-1mm]  31.62 21.16 270 top
TP4  -  [Test-Point-1mm]  27.44 2.33 90 top
TP5  -  [Test-Point-1mm]  27.57 9.51 270 top
TP6  -  [Test-Point-1mm]  27.01 16.51 270 top
U1  CC6920SO-20A  [SOP-8_L5.0-W4.0-P1.27-LS6.2-BL]  21.64 40.94 0 top
U2  LM7812S2/TR  [TO-263-2_L10.2-W8.7-P5.08-LS15.1-BL]  10.72 29.12 90 top
U3  EG2134  [TSSOP-20_L6.5-W4.4-P0.65-LS6.4-BL]  31.93 38.96 270 top
U4  CJU1117B-3.3  [TO-252-2_L6.6-W6.1-P4.57-LS9.9-TL-CW]  7.43 56.82 180 top
U5  STM32G473CBT6  [LQFP-48_L7.0-W7.0-P0.50-LS9.0-BL]  34.03 49.69 180 top
X1  8MHz  [CRYSTAL-SMD_L5.0-W3.2]  34.51 59.97 0 top

## Footprints (pads in the part's own frame, mm; a bottom-side part is the same pattern mirrored in y, then rotated)
C0402
  rect 0.79x0.54 smd: 1(-0.545,0) 2(0.545,0)
C0402_NEW
  rect 0.79x0.54 smd: 1(-0.545,0) 2(0.545,0)
C0603
  rect 0.8x0.9 smd: 1(-0.7,0) 2(0.7,0)
C1206
  rect 1.485x1.728 smd: 1(-1.593,0) 2(1.593,0)
CAP-SMD_BD6.3-L6.6-W6.6-LS7.4-FD
  rect 3.5x1.2 smd: 1(-2.67,0) 2(2.67,0)
CAP-SMD_BD10.0-L10.3-W10.3-LS11.0-FD
  rect 4.5x1.65 smd: 1(-4.5,0) 2(4.5,0)
CONN-TH_3P-P2.54_2501S-3P
  rect 1.6x1.6 hole 1: 1(-2.54,0)
  round 1.6 hole 1: 2(0,0) 3(2.54,0)
CONN-TH_12P-P3.00_HC-MX3.0-2X6A
  rect 1.8x1.8 hole 1.02: 1(-7.5,1.5)
  round 1.8 hole 1.02: 2(-7.5,-1.5) 3(-4.5,1.5) 4(-4.5,-1.5) 5(-1.5,1.5) 6(-1.5,-1.5) 7(1.5,1.5) 8(1.5,-1.5) 9(4.5,1.5) 10(4.5,-1.5) 11(7.5,1.5) 12(7.5,-1.5)
CRYSTAL-SMD_L5.0-W3.2
  rect 1.9x2.4 smd: 1(-2.05,0) 2(2.05,0)
HDR-TH_8P-P2.54-V-M
  rect 1.5x1.5 hole 1: 1(-8.89,0)
  round 1.5 hole 1: 2(-6.35,0) 3(-3.81,0) 4(-1.27,0) 5(1.27,0) 6(3.81,0) 7(6.35,0) 8(8.89,0)
L0805
  rect 1.133x1.377 smd: 1(-0.966,0) 2(0.966,0)
LED0603-RD_RED
  rect 0.8x0.8 smd: 1(-0.799,-0.004) 2(0.799,0.004)
LQFP-48_L7.0-W7.0-P0.50-LS9.0-BL
  oval 0.27x1.5 smd: 1(-2.75,-4.25) 2(-2.25,-4.25) 3(-1.75,-4.25) 4(-1.25,-4.25) 5(-0.75,-4.25) 6(-0.25,-4.25) 7(0.25,-4.25) 8(0.75,-4.25) 9(1.25,-4.25) 10(1.75,-4.25) 11(2.25,-4.25) 12(2.75,-4.25) 25(2.75,4.25) 26(2.25,4.25) 27(1.75,4.25) 28(1.25,4.25) 29(0.75,4.25) 30(0.25,4.25) 31(-0.25,4.25) 32(-0.75,4.25) 33(-1.25,4.25) 34(-1.75,4.25) 35(-2.25,4.25) 36(-2.75,4.25)
  oval 1.5x0.27 smd: 13(4.25,-2.75) 14(4.25,-2.25) 15(4.25,-1.75) 16(4.25,-1.25) 17(4.25,-0.75) 18(4.25,-0.25) 19(4.25,0.25) 20(4.25,0.75) 21(4.25,1.25) 22(4.25,1.75) 23(4.25,2.25) 24(4.25,2.75) 37(-4.25,2.75) 38(-4.25,2.25) 39(-4.25,1.75) 40(-4.25,1.25) 41(-4.25,0.75) 42(-4.25,0.25) 43(-4.25,-0.25) 44(-4.25,-0.75) 45(-4.25,-1.25) 46(-4.25,-1.75) 47(-4.25,-2.25) 48(-4.25,-2.75)
R0402
  rect 0.566x0.54 smd: 1(-0.433,0) 2(0.433,0)
R0603
  rect 0.806x0.864 smd: 1(-0.753,0) 2(0.753,0)
SOD-123_L2.7-W1.6-LS3.7-FD
  rect 0.88x0.96 smd: 1(-1.61,0) 2(1.61,0)
SOP-8_L5.0-W4.0-P1.27-LS6.2-BL
  oval 0.7x1.7 smd: 1(-1.905,-2.9) 2(-0.635,-2.9) 3(0.635,-2.9) 4(1.905,-2.9) 5(1.905,2.9) 6(0.635,2.9) 7(-0.635,2.9) 8(-1.905,2.9)
Test-Point-1mm
  round 1 smd: 1(0,0)
TO-252-2_L6.6-W6.1-P4.57-LS9.9-TL-CW
  rect 2.8x1.3 smd: 1(-3.292,2.273) 3(-3.292,-2.273)
  rect 6.5x6 smd: 2(3.292,0)
TO-252-2_L6.6-W6.1-P4.57-LS10.1-TL-CW
  rect 3x1.6 smd: 1(-3.424,2.285) 3(-3.424,-2.285)
  rect 6.2x5.8 smd: 2(3.424,0)
TO-252-2_L6.6-W6.1-P4.58-LS10.1-BR-CW
  rect 2.364x1.064 smd: 1(3.462,-2.286) 3(3.462,2.286)
  rect 6.004x5.512 smd: 2(-3.462,0)
TO-263-2_L10.2-W8.7-P5.08-LS15.1-BL
  rect 1.7x3.6 smd: 1(-2.54,-5.293) 3(2.54,-5.293)
  rect 11x9 smd: 2(0,5.293)
TSSOP-20_L6.5-W4.4-P0.65-LS6.4-BL
  oval 0.364x1.742 smd: 1(-2.925,-2.871) 2(-2.275,-2.871) 3(-1.625,-2.871) 4(-0.975,-2.871) 5(-0.325,-2.871) 6(0.325,-2.871) 7(0.975,-2.871) 8(1.625,-2.871) 9(2.275,-2.871) 10(2.925,-2.871) 11(2.925,2.871) 12(2.275,2.871) 13(1.625,2.871) 14(0.975,2.871) 15(0.325,2.871) 16(-0.325,2.871) 17(-0.975,2.871) 18(-1.625,2.871) 19(-2.275,2.871) 20(-2.925,2.871)

## Nets
As in the schematic.

Pads without a net: U1 6; U5 11 12 16 17 18 22 25 26 33 34 39 40 41 42 46

## Via types
v1: diameter 0.61, hole 0.305, Top Layer to Bottom Layer, 246 vias

## Routing (per net, layer and track width the routed paths; a pad name or vN(x,y) marks a point on that pad's centre or on a via; arc(x,y) is an arc through that point)
3V3: length 9.5
  Top Layer w0.6: U4.2 6.73,59.41 R8.1 8.34,61.44 C11.2 10.49,61.47 C12.2
12V: length 36.2
  Top Layer w0.254: R2.1 10.62,36.38 C3.2
  Top Layer w0.6: U4.3 13,56.81 13,44.66 LDO1.1 10.86,39.36 13.74,36.48 ; 13.74,36.48 C4.1 15.2,32.47 U2.3 ; 13.74,36.48 C3.2
+5V: length 7.6
  Top Layer w0.6: LDO1.3 11.36,47.59 C8.2 9.79,49.82 9.59,49.62 C7.2 6.79,49.62 R7.1
GND: length 18.3
  Top Layer w0.254: C23.1 38.01,57.41 38.23,57.63 38.23,61.96 37.98,62.22 31.01,62.22 30.75,61.96 30.75,57.59 30.93,57.41 C24.1
  vias: v1(1.08,53.06) v1(1.08,52.31) v1(1.53,46.97) v1(1.55,46.2) v1(1.57,45.47) v1(1.59,44.7) v1(1.58,43.96) v1(1.6,43.19) v1(1.58,42.48) v1(1.77,53.08) v1(1.79,52.31) v1(2.24,46.97) v1(2.26,46.2) v1(2.28,45.47) v1(2.3,44.7) v1(2.29,43.96) v1(2.31,43.19) v1(2.3,42.48) v1(2.49,53.08) v1(2.51,52.31) v1(2.94,46.97) v1(2.96,46.2) v1(2.98,45.47) v1(3,44.7) v1(2.99,43.96) v1(3.01,43.19) v1(3,42.48) v1(3.2,53.08) v1(3.22,52.31) v1(3.65,46.97) v1(3.67,46.2) v1(3.69,45.47) v1(3.71,44.7) v1(3.69,43.96) v1(3.71,43.19) v1(3.7,42.48) v1(3.9,53.08) v1(3.92,52.31) v1(4.34,46.97) v1(4.36,46.2) v1(4.38,45.47) v1(4.4,44.7) v1(4.39,43.96) v1(4.41,43.19) v1(4.4,42.48) v1(4.6,53.08) v1(4.62,52.31) v1(5.05,46.97) v1(5.07,46.2) v1(5.09,45.47) v1(5.11,44.7) v1(5.1,43.96) v1(5.12,43.19) v1(5.11,42.48) v1(5.3,53.08) v1(5.32,52.31) v1(5.77,46.97) v1(5.79,46.2) v1(5.81,45.47) v1(5.83,44.7) v1(5.82,43.96) v1(5.84,43.19) v1(5.83,42.48) v1(6.01,53.08) v1(6.03,52.31) v1(6.48,46.97) v1(6.48,46.22) v1(6.52,45.47) v1(6.52,44.72) v1(6.53,43.96) v1(6.53,43.2) v1(6.54,42.48) v1(6.89,53.07) v1(6.91,52.3) v1(7.53,47.18) v1(7.53,46.47) v1(7.53,45.77) v1(7.53,45.06) v1(7.53,44.37) v1(7.53,43.66) v1(7.53,42.94) v1(7.54,42.25) v1(7.61,53.07) v1(7.63,52.3) v1(8.31,53.07) v1(8.33,52.3) v1(8.3,47.2) v1(8.3,46.49) v1(8.3,45.79) v1(8.3,45.08) v1(8.3,44.39) v1(8.3,43.68) v1(8.3,42.96) v1(8.3,42.25) v1(9.01,53.07) v1(9.03,52.3) v1(9.71,53.07) v1(9.73,52.3) v1(10.42,53.07) v1(10.44,52.3) v1(11.14,53.07) v1(11.16,52.3) v1(11.85,53.07) v1(11.85,52.32) v1(14.36,56.75) v1(14.36,56.05) v1(14.36,55.32) v1(14.36,54.61) v1(14.36,53.92) v1(14.36,53.21) v1(14.36,52.51) v1(14.36,51.8) v1(14.51,48) v1(14.51,47.29) v1(14.51,46.57) v1(14.51,45.86) v1(14.51,45.16) v1(14.51,44.46) v1(14.51,43.76) v1(14.51,43.04) v1(15.11,56.75) v1(15.13,56.06) v1(15.13,55.34) v1(15.13,54.63) v1(15.13,53.94) v1(15.13,53.23) v1(15.13,52.53) v1(15.13,51.82) v1(15.26,48) v1(15.28,47.31) v1(15.28,46.59) v1(15.28,45.88) v1(15.28,45.18) v1(15.28,44.48) v1(15.28,43.78) v1(15.28,43.06) v1(16.03,48.01) v1(16.03,47.3) v1(16.03,46.58) v1(16.03,45.87) v1(16.03,45.17) v1(16.03,44.47) v1(16.03,43.77) v1(16.03,43.06) v1(25.4,62.99) v1(25.4,62.24) v1(26.09,63) v1(26.11,62.24) v1(26.81,63) v1(26.83,62.24) v1(27.52,63) v1(27.54,62.24) v1(27.63,61.43) v1(27.63,60.72) v1(27.63,60) v1(27.63,59.29) v1(27.63,58.6) v1(27.63,57.89) v1(27.63,57.19) v1(27.63,56.48) v1(28.22,63) v1(28.24,62.24) v1(28.38,61.43) v1(28.39,60.74) v1(28.39,60.02) v1(28.39,59.31) v1(28.39,58.62) v1(28.39,57.91) v1(28.39,57.21) v1(28.39,56.5) v1(28.92,63) v1(28.94,62.24) v1(29.31,61.45) v1(29.31,60.74) v1(29.31,60.02) v1(29.31,59.31) v1(29.31,58.61) v1(29.31,57.91) v1(29.31,57.21) v1(29.31,56.49) v1(29.62,63) v1(29.64,62.24) v1(30.06,61.45) v1(30.07,60.76) v1(30.07,60.04) v1(30.07,59.33) v1(30.07,58.63) v1(30.07,57.93) v1(30.07,57.23) v1(30.07,56.51) v1(30.34,63) v1(30.35,62.24) v1(31.92,63.15) v1(31.94,62.38) v1(32.63,63.15) v1(32.65,62.38) v1(33.33,63.15) v1(33.35,62.38) v1(34.04,63.15) v1(34.06,62.38) v1(34.73,63.15) v1(34.75,62.38) v1(35.44,63.15) v1(35.46,62.38) v1(36.16,63.15) v1(36.18,62.38) v1(36.87,63.15) v1(36.87,62.39) v1(39.05,62.2) v1(39.05,61.49) v1(39.05,60.76) v1(39.05,60.05) v1(39.05,59.36) v1(39.05,58.65) v1(39.05,57.96) v1(39.05,57.24) v1(39.8,62.2) v1(39.81,61.51) v1(39.81,60.78) v1(39.81,60.07) v1(39.81,59.38) v1(39.81,58.67) v1(39.81,57.98) v1(39.81,57.26) v1(40.7,62.22) v1(40.7,61.51) v1(40.7,60.79) v1(40.7,60.08) v1(40.7,59.38) v1(40.7,58.68) v1(40.7,57.98) v1(40.7,57.27) v1(41.45,62.22) v1(41.47,61.53) v1(41.47,60.81) v1(41.47,60.1) v1(41.47,59.4) v1(41.47,58.7) v1(41.47,58) v1(41.47,57.29)
MAH_TIM1CH1P_PA08: length 7.1
  Top Layer w0.254: U5.30 33.78,43.98 31.69,41.89 U3.1
MAL_TIM1CH1N_PB13: length 8.5
  Top Layer w0.254: U5.27 32.28,44.47 31.82,44.01 v1(30.29,44.01) ; v1(30.29,39.93) 29.06,39.93 U3.4
  Bottom Layer w0.254: v1(30.29,44.01) v1(30.29,39.93)
MBH_TIM1CH2P_PA09: length 7.8
  Top Layer w0.254: U3.2 31.54,41.24 34.28,43.98 U5.31
MBL_TIM1CH2N_PB14: length 9.3
  Top Layer w0.254: v1(31.01,43.4) 31.82,43.4 32.78,44.36 U5.28 ; v1(31.01,39.27) 29.07,39.27 U3.5
  Bottom Layer w0.254: v1(31.01,43.4) v1(31.01,39.27)
MCH_TIM1CH3P_PA10: length 8.6
  Top Layer w0.254: 29.06,40.59 31.4,40.59 34.78,43.97 U5.32
MCL_TIM1CH3N_PB15: length 10.2
  Top Layer w0.254: v1(31.67,42.79) 31.82,42.79 33.28,44.25 U5.29 ; U3.6 31.65,38.64 v1(31.67,38.66)
  Bottom Layer w0.254: v1(31.67,42.79) v1(31.67,38.66)
OSC_IN: length 7.5
  Top Layer w0.254: U5.5 34.78,57.17 R26.1 36.26,57.36 C23.2 36.3,59.72 X1.2
OSC_OUT: length 7.5
  Top Layer w0.254: X1.1 32.78,59.66 C24.2 32.82,57.36 R26.2 34.28,57.19 U5.6
POWER: length 2.6
  Top Layer w0.254: C2.2 5.43,36.35 3.84,36.35
  Top Layer w1: 23.1,33.67 C1.1 ; 6.48,19.74 CN1.1
RPM_SIG: length 4.5
  Top Layer w0.254: 20.3,57 20.53,57.23 20.53,61.38
$1N16780: length 1.8
  Top Layer w0.254: 5.02,51.12 6.76,51.12 R7.2
$1N16782: length 1.7
  Top Layer w0.254: LED1.2 8.97,37.94 9.02,37.88
$1N17439: length 1.6
  Top Layer w0.254: R16.1 3.83,37.85 R20.2
$1N20263: length 2.9
  Top Layer w0.254: R19.1 R17.1 17.44,57.13 R21.2

## Copper pours and planes (outline as drawn; the poured copper is in the pictures)
AGND on Top Layer: 19.03,46.46 26.55,46.46 26.55,41.93 19.03,41.93
GND on Top Layer: 0,63.95 48.43,63.95 48.43,42.66 47.37,41.6 45.34,41.6 45.34,38.05 43.86,36.56 37.89,36.56 37.69,36.77 36.87,36.77 35.96,35.85 27.05,35.85 27.05,62.63 16.82,62.63 16.82,35.39 0,35.39
GND on Bottom Layer: 0.02,63.95 48.45,63.95 48.45,42.66 47.39,41.6 45.37,41.6 45.37,38.05 43.88,36.56 37.92,36.56 37.71,36.77 36.9,36.77 35.98,35.85 27.62,35.85 27.62,47.89 16.09,47.89 16.09,35.44 0.02,35.44
POWER on Top Layer: 6.38,27.49 14.42,27.49 14.42,18.77 6.38,18.77
POWER on Top Layer: 19.2,33.47 21.55,33.47 21.55,26.7 19.2,26.7
POWER on Top Layer: 19.16,35.93 22.97,35.93 22.97,28.93 19.16,28.93
POWER on Top Layer: 19.2,38.95 21.5,38.95 21.5,32.17 19.2,32.17
POWER on Top Layer: 4.9,20.96 7.87,20.96 7.87,15.71 4.9,15.71
POWER on Top Layer: 14.21,27.49 21.54,27.49 21.54,25.69 14.21,25.69
POWER_1 on Top Layer: 24.86,38.96 26.65,38.96 26.65,31.62 24.86,31.62
POWER_1 on Top Layer: 21.85,38.93 26.08,38.93 26.08,37.14 21.85,37.14
POWER_1 on Top Layer: 24.84,33.35 46.92,33.35 46.92,1.68 24.84,1.68
